# EAGLE schematic C (EAGLE 9.6.2)
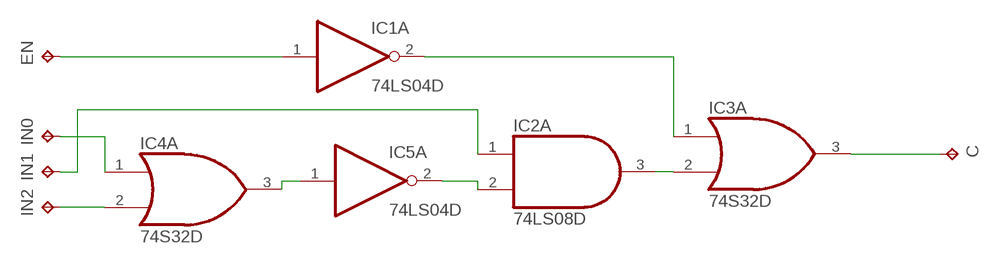
[diagram p0: schematic, sheet 1]

## Parts
C  TPB1,27  [B1,27]
EN  TPB1,27  [B1,27]
IC1  74LS04D  [SO14]
IC2  74LS08D  [SO14]
IC3  74S32D  [SO14]
IC4  74S32D  [SO14]
IC5  74LS04D  [SO14]
IN0  TPB1,27  [B1,27]
IN1  TPB1,27  [B1,27]
IN2  TPB1,27  [B1,27]

## Nets
N$1: IC4.1(A:I0) IN0.TP
N$2: IC4.3(A:O) IC5.1(A:I)
N$3: IC4.2(A:I1) IN2.TP
N$4: IC2.2(A:I1) IC5.2(A:O)
N$5: EN.TP IC1.1(A:I)
N$6: IC1.2(A:O) IC3.1(A:I0)
N$7: IC2.1(A:I0) IN1.TP
N$8: C.TP IC3.3(A:O)
N$9: IC2.3(A:O) IC3.2(A:I1)
Unconnected: IC1.3(B:I) IC1.4(B:O) IC1.5(C:I) IC1.6(C:O) IC1.8(D:O) IC1.9(D:I) IC1.10(E:O) IC1.11(E:I) IC1.12(F:O) IC1.13(F:I) IC2.4(B:I0) IC2.5(B:I1) IC2.6(B:O) IC2.8(C:O) IC2.9(C:I0) IC2.10(C:I1) IC2.11(D:O) IC2.12(D:I0) IC2.13(D:I1) IC3.4(B:I0) IC3.5(B:I1) IC3.6(B:O) IC3.8(C:O) IC3.9(C:I0) IC3.10(C:I1) IC3.11(D:O) IC3.12(D:I0) IC3.13(D:I1) IC4.4(B:I0) IC4.5(B:I1) IC4.6(B:O) IC4.8(C:O) IC4.9(C:I0) IC4.10(C:I1) IC4.11(D:O) IC4.12(D:I0) IC4.13(D:I1) IC5.3(B:I) IC5.4(B:O) IC5.5(C:I) IC5.6(C:O) IC5.8(D:O) IC5.9(D:I) IC5.10(E:O) IC5.11(E:I) IC5.12(F:O) IC5.13(F:I)

## Power pins joined to a net without a drawn wire
GND: IC1.7(P:GND) IC2.7(P:GND) IC3.7(P:GND) IC4.7(P:GND) IC5.7(P:GND)
VCC: IC1.14(P:VCC) IC2.14(P:VCC) IC3.14(P:VCC) IC4.14(P:VCC) IC5.14(P:VCC)

## Library data of the parts
C EN IN0 IN1 IN2 = testpad:TP: Test pad
IC1 IC5 = 74xx-us:74*04: Hex INVERTER
IC2 = 74xx-us:74*08: Quad 2-input AND gate
IC3 IC4 = 74xx-us:74*32: Quad 2-input OR gate